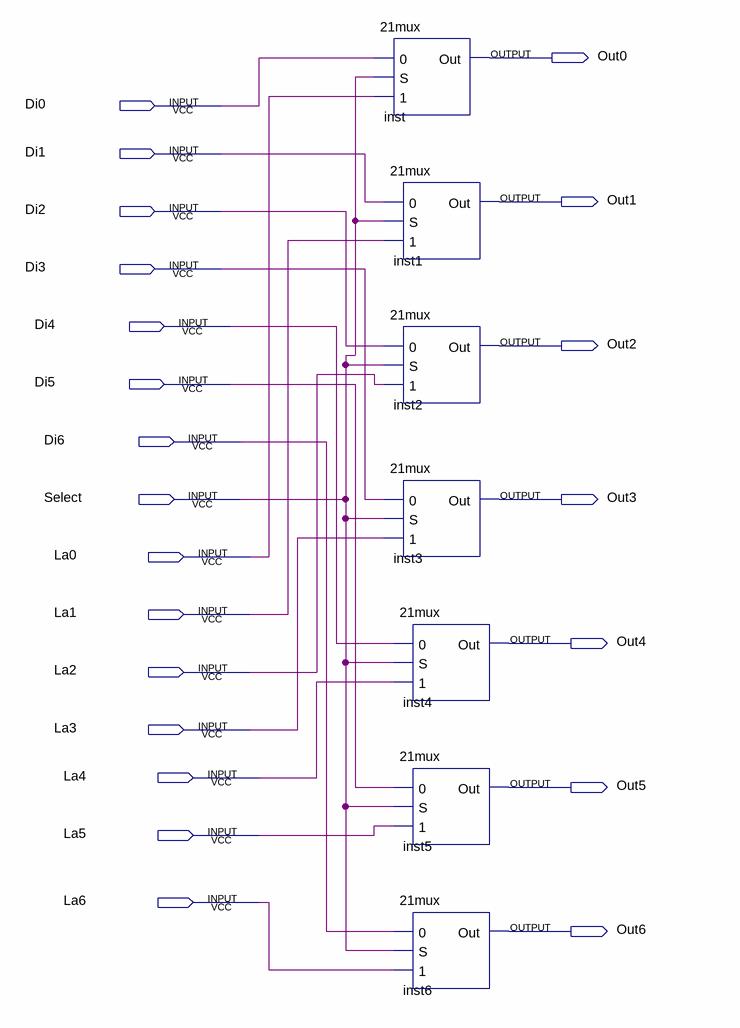
[diagram p0: schematic sheet]
// Quartus schematic sev_bit_mux.bdf as structural Verilog: 7 symbols, 22 pins
module sev_bit_mux (
  input  Di0,
  input  Di1,
  input  Di2,
  input  Di3,
  input  Di4,
  input  Di5,
  input  Di6,
  input  Select,
  input  La0,
  input  La1,
  input  La2,
  input  La3,
  input  La4,
  input  La5,
  input  La6,
  output Out0,
  output Out1,
  output Out2,
  output Out3,
  output Out4,
  output Out5,
  output Out6
);

  \21mux  inst (.\0 (Di0), .S(Select), .\1 (La0), .Out(Out0));
  \21mux  inst1 (.\0 (Di1), .S(Select), .\1 (La1), .Out(Out1));
  \21mux  inst2 (.\0 (Di2), .S(Select), .\1 (La2), .Out(Out2));
  \21mux  inst3 (.\0 (Di3), .S(Select), .\1 (La3), .Out(Out3));
  \21mux  inst4 (.\0 (Di4), .S(Select), .\1 (La4), .Out(Out4));
  \21mux  inst5 (.\0 (Di5), .S(Select), .\1 (La5), .Out(Out5));
  \21mux  inst6 (.\0 (Di6), .S(Select), .\1 (La6), .Out(Out6));
endmodule
